# Altium schematic sheet PythonOrC_HAB__CosmicRayHAB__AP2138N-3.3.schdoc
size 57 x 37 mm
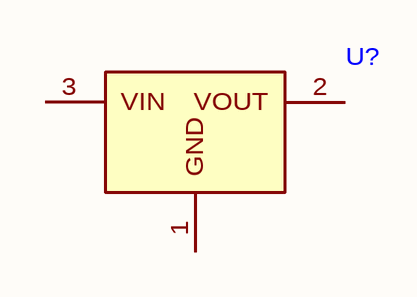
[diagram p0: PythonOrC_HAB__CosmicRayHAB__AP2138N-3.3.schdoc]

## Parts
U?  (no value)  [SOT-23]

## Nets

Not connected (* = marked no-connect by the designer): U? 1(GND) 2(VOUT) 3(VIN)

## Library data of the parts
U? = AP2138N-3.3